# Altium schematic sheet 阵列磁传感器.SchDoc
size A3
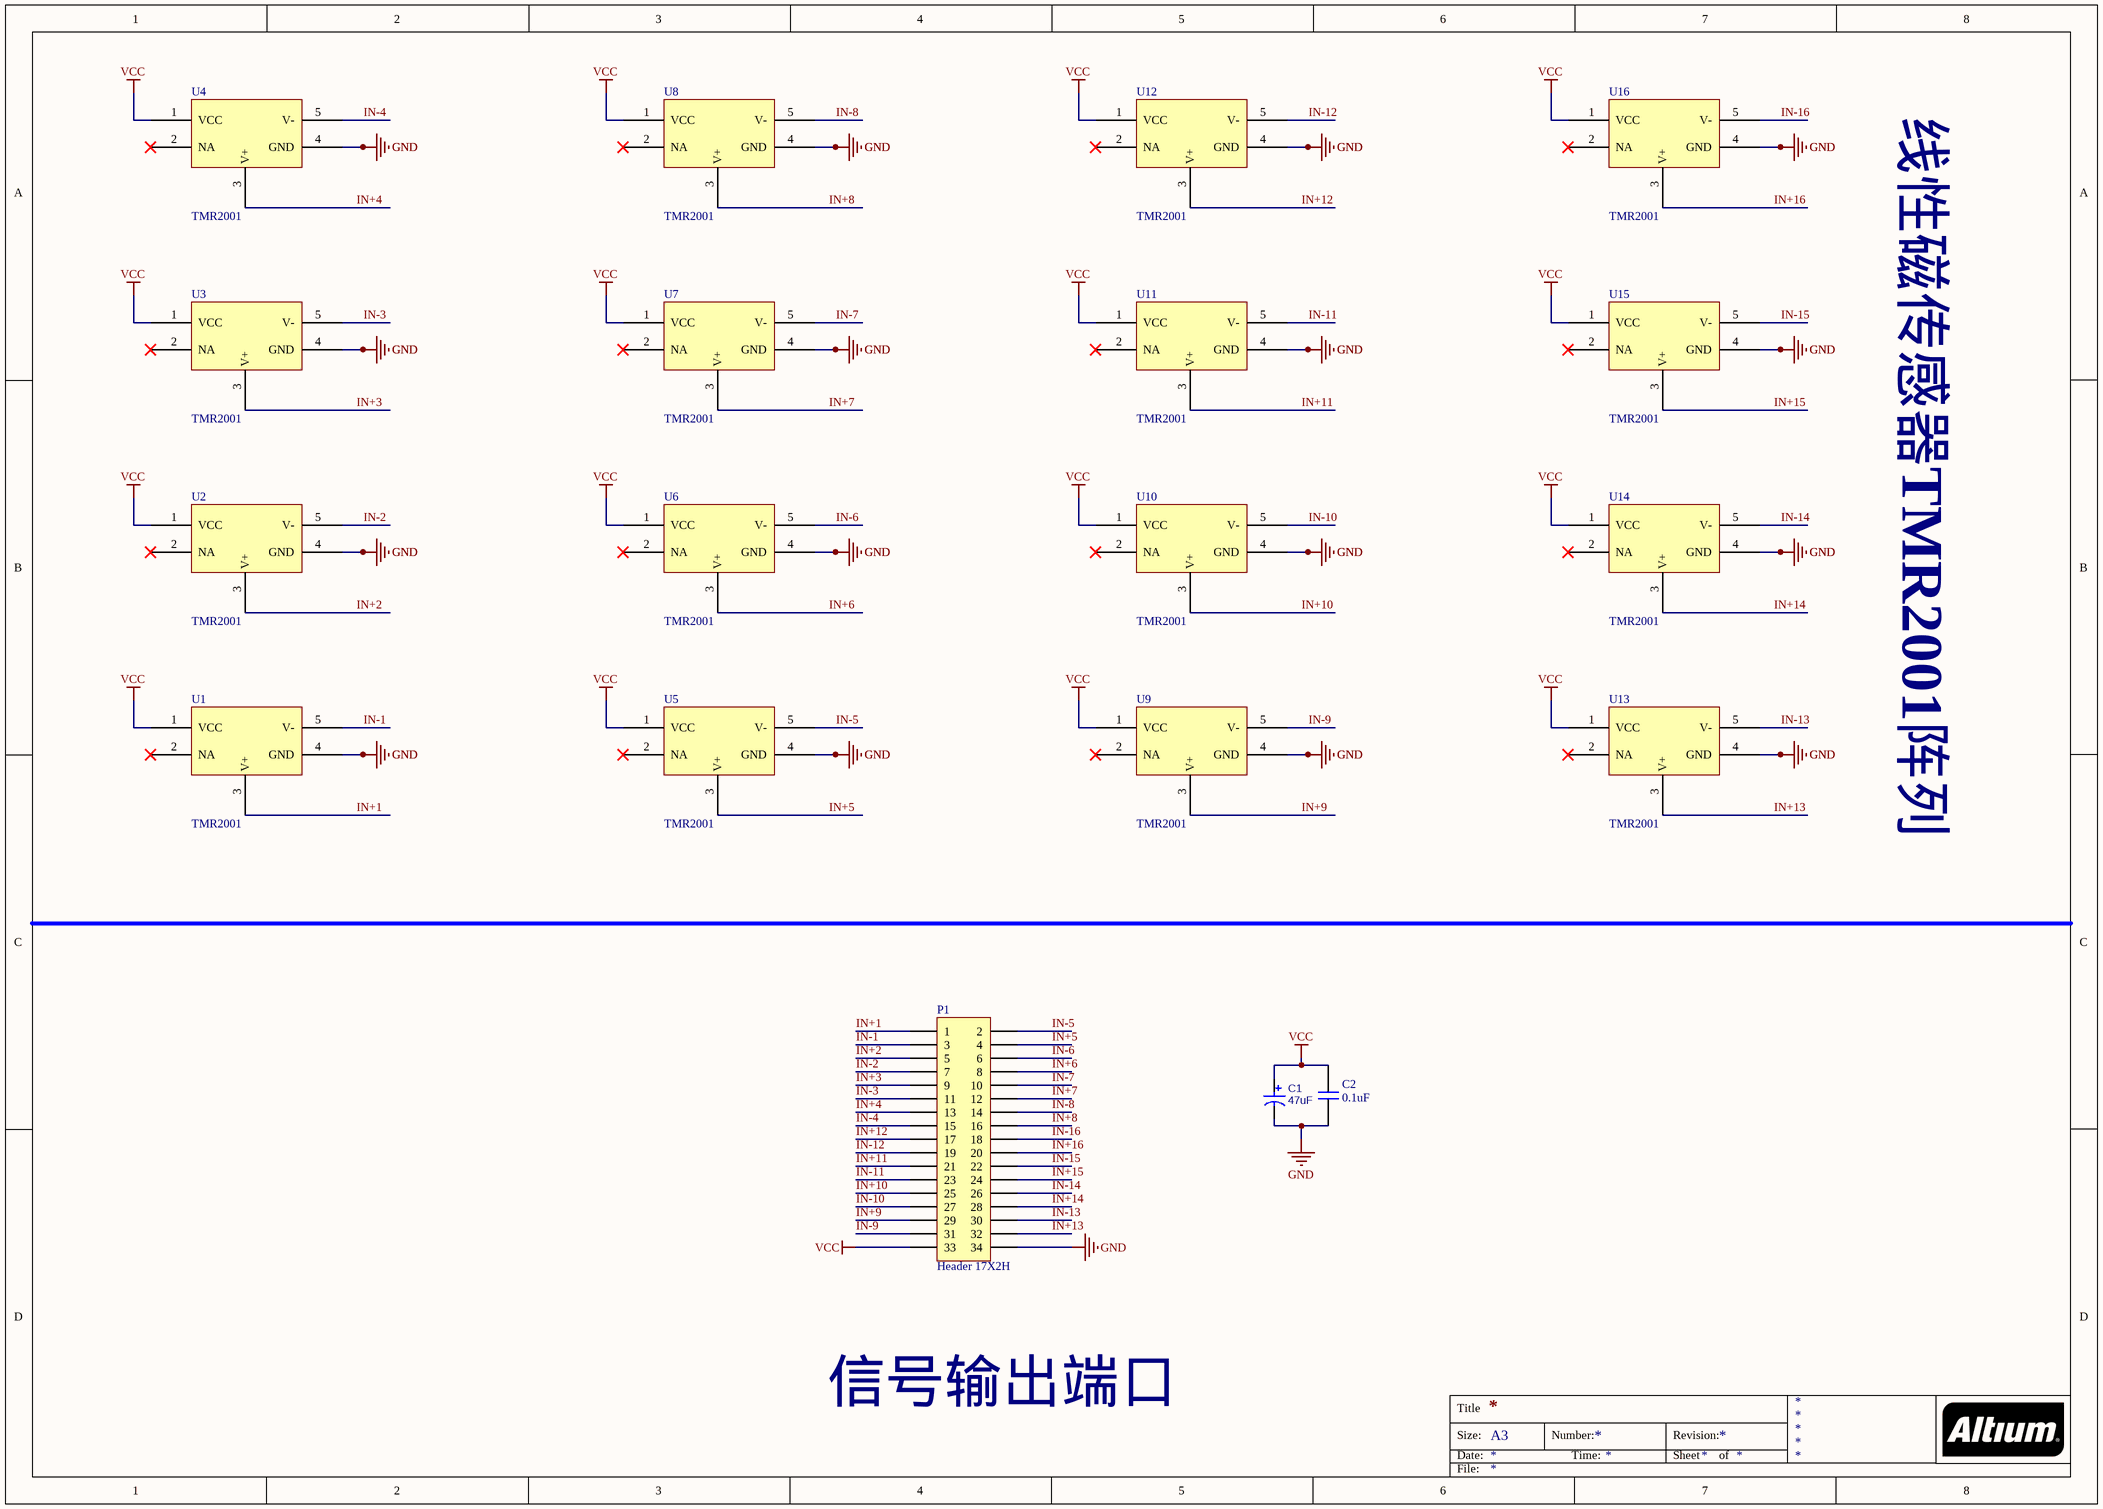
[diagram p0: 阵列磁传感器.SchDoc]

## Parts
C1  47uF  [CAP-SMD_BD6.3-L6.6-W6.6-LS7.2-FD]
C2  0.1uF  [0805C]
P1  Header 17X2H  [HDR2X17]
U1  TMR2001  [SOT95P280X145-5N]
U2  TMR2001  [SOT95P280X145-5N]
U3  TMR2001  [SOT95P280X145-5N]
U4  TMR2001  [SOT95P280X145-5N]
U5  TMR2001  [SOT95P280X145-5N]
U6  TMR2001  [SOT95P280X145-5N]
U7  TMR2001  [SOT95P280X145-5N]
U8  TMR2001  [SOT95P280X145-5N]
U9  TMR2001  [SOT95P280X145-5N]
U10  TMR2001  [SOT95P280X145-5N]
U11  TMR2001  [SOT95P280X145-5N]
U12  TMR2001  [SOT95P280X145-5N]
U13  TMR2001  [SOT95P280X145-5N]
U14  TMR2001  [SOT95P280X145-5N]
U15  TMR2001  [SOT95P280X145-5N]
U16  TMR2001  [SOT95P280X145-5N]

## Nets
GND: C1.2 C2.1 P1.34 U1.4(GND) U2.4(GND) U3.4(GND) U4.4(GND) U5.4(GND) U6.4(GND) U7.4(GND) U8.4(GND) U9.4(GND) U10.4(GND) U11.4(GND) U12.4(GND) U13.4(GND) U14.4(GND) U15.4(GND) U16.4(GND)
VCC: C1.1 C2.2 P1.33 U1.1(VCC) U2.1(VCC) U3.1(VCC) U4.1(VCC) U5.1(VCC) U6.1(VCC) U7.1(VCC) U8.1(VCC) U9.1(VCC) U10.1(VCC) U11.1(VCC) U12.1(VCC) U13.1(VCC) U14.1(VCC) U15.1(VCC) U16.1(VCC)
IN+1: P1.1 U1.3(V+)
IN+2: P1.5 U2.3(V+)
IN+3: P1.9 U3.3(V+)
IN+4: P1.13 U4.3(V+)
IN+5: P1.4 U5.3(V+)
IN+6: P1.8 U6.3(V+)
IN+7: P1.12 U7.3(V+)
IN+8: P1.16 U8.3(V+)
IN+9: P1.29 U9.3(V+)
IN+10: P1.25 U10.3(V+)
IN+11: P1.21 U11.3(V+)
IN+12: P1.17 U12.3(V+)
IN+13: P1.32 U13.3(V+)
IN+14: P1.28 U14.3(V+)
IN+15: P1.24 U15.3(V+)
IN+16: P1.20 U16.3(V+)
IN-1: P1.3 U1.5(V-)
IN-2: P1.7 U2.5(V-)
IN-3: P1.11 U3.5(V-)
IN-4: P1.15 U4.5(V-)
IN-5: P1.2 U5.5(V-)
IN-6: P1.6 U6.5(V-)
IN-7: P1.10 U7.5(V-)
IN-8: P1.14 U8.5(V-)
IN-9: P1.31 U9.5(V-)
IN-10: P1.27 U10.5(V-)
IN-11: P1.23 U11.5(V-)
IN-12: P1.19 U12.5(V-)
IN-13: P1.30 U13.5(V-)
IN-14: P1.26 U14.5(V-)
IN-15: P1.22 U15.5(V-)
IN-16: P1.18 U16.5(V-)

Not connected (* = marked no-connect by the designer): U1 2(NA)*; U2 2(NA)*; U3 2(NA)*; U4 2(NA)*; U5 2(NA)*; U6 2(NA)*; U7 2(NA)*; U8 2(NA)*; U9 2(NA)*; U10 2(NA)*; U11 2(NA)*; U12 2(NA)*; U13 2(NA)*; U14 2(NA)*; U15 2(NA)*; U16 2(NA)*

## Notes on the sheet
- 线性磁传感器TMR2001阵列
- 信号输出端口
- Title
- Size:
- Date:
- A3
- Number:
- Time:
- Revision:
- Sheet
- of
- File:

## Library data of the parts
C1 = 10uF: 极性电解电容; BOM_Manufacturer: ValuePro; BOM_Manufacturer Part: Non - polar electrolytic capacitors10uf 100v; nameAlias: Capacitance; BOM_Supplier: LCSC; BOM_Supplier Part: C56706; BOM_JLCPCB Part Class: Extended Part; spicePre: C; spiceSymbolName: Non - polar electrolytic capacitors10uf 100v
C2 = CAP: 普通电容
P1 = Header 17X2H: Header, 17-Pin, Dual row, Right Angle; LatestRevisionDate: 17-Jul-2002; LatestRevisionNote: Re-released for DXP Platform.; Publisher: Altium Limited
U1-U16 = TMR2001: 线性磁传感器